# Altium project PCB_Project.PrjPcb
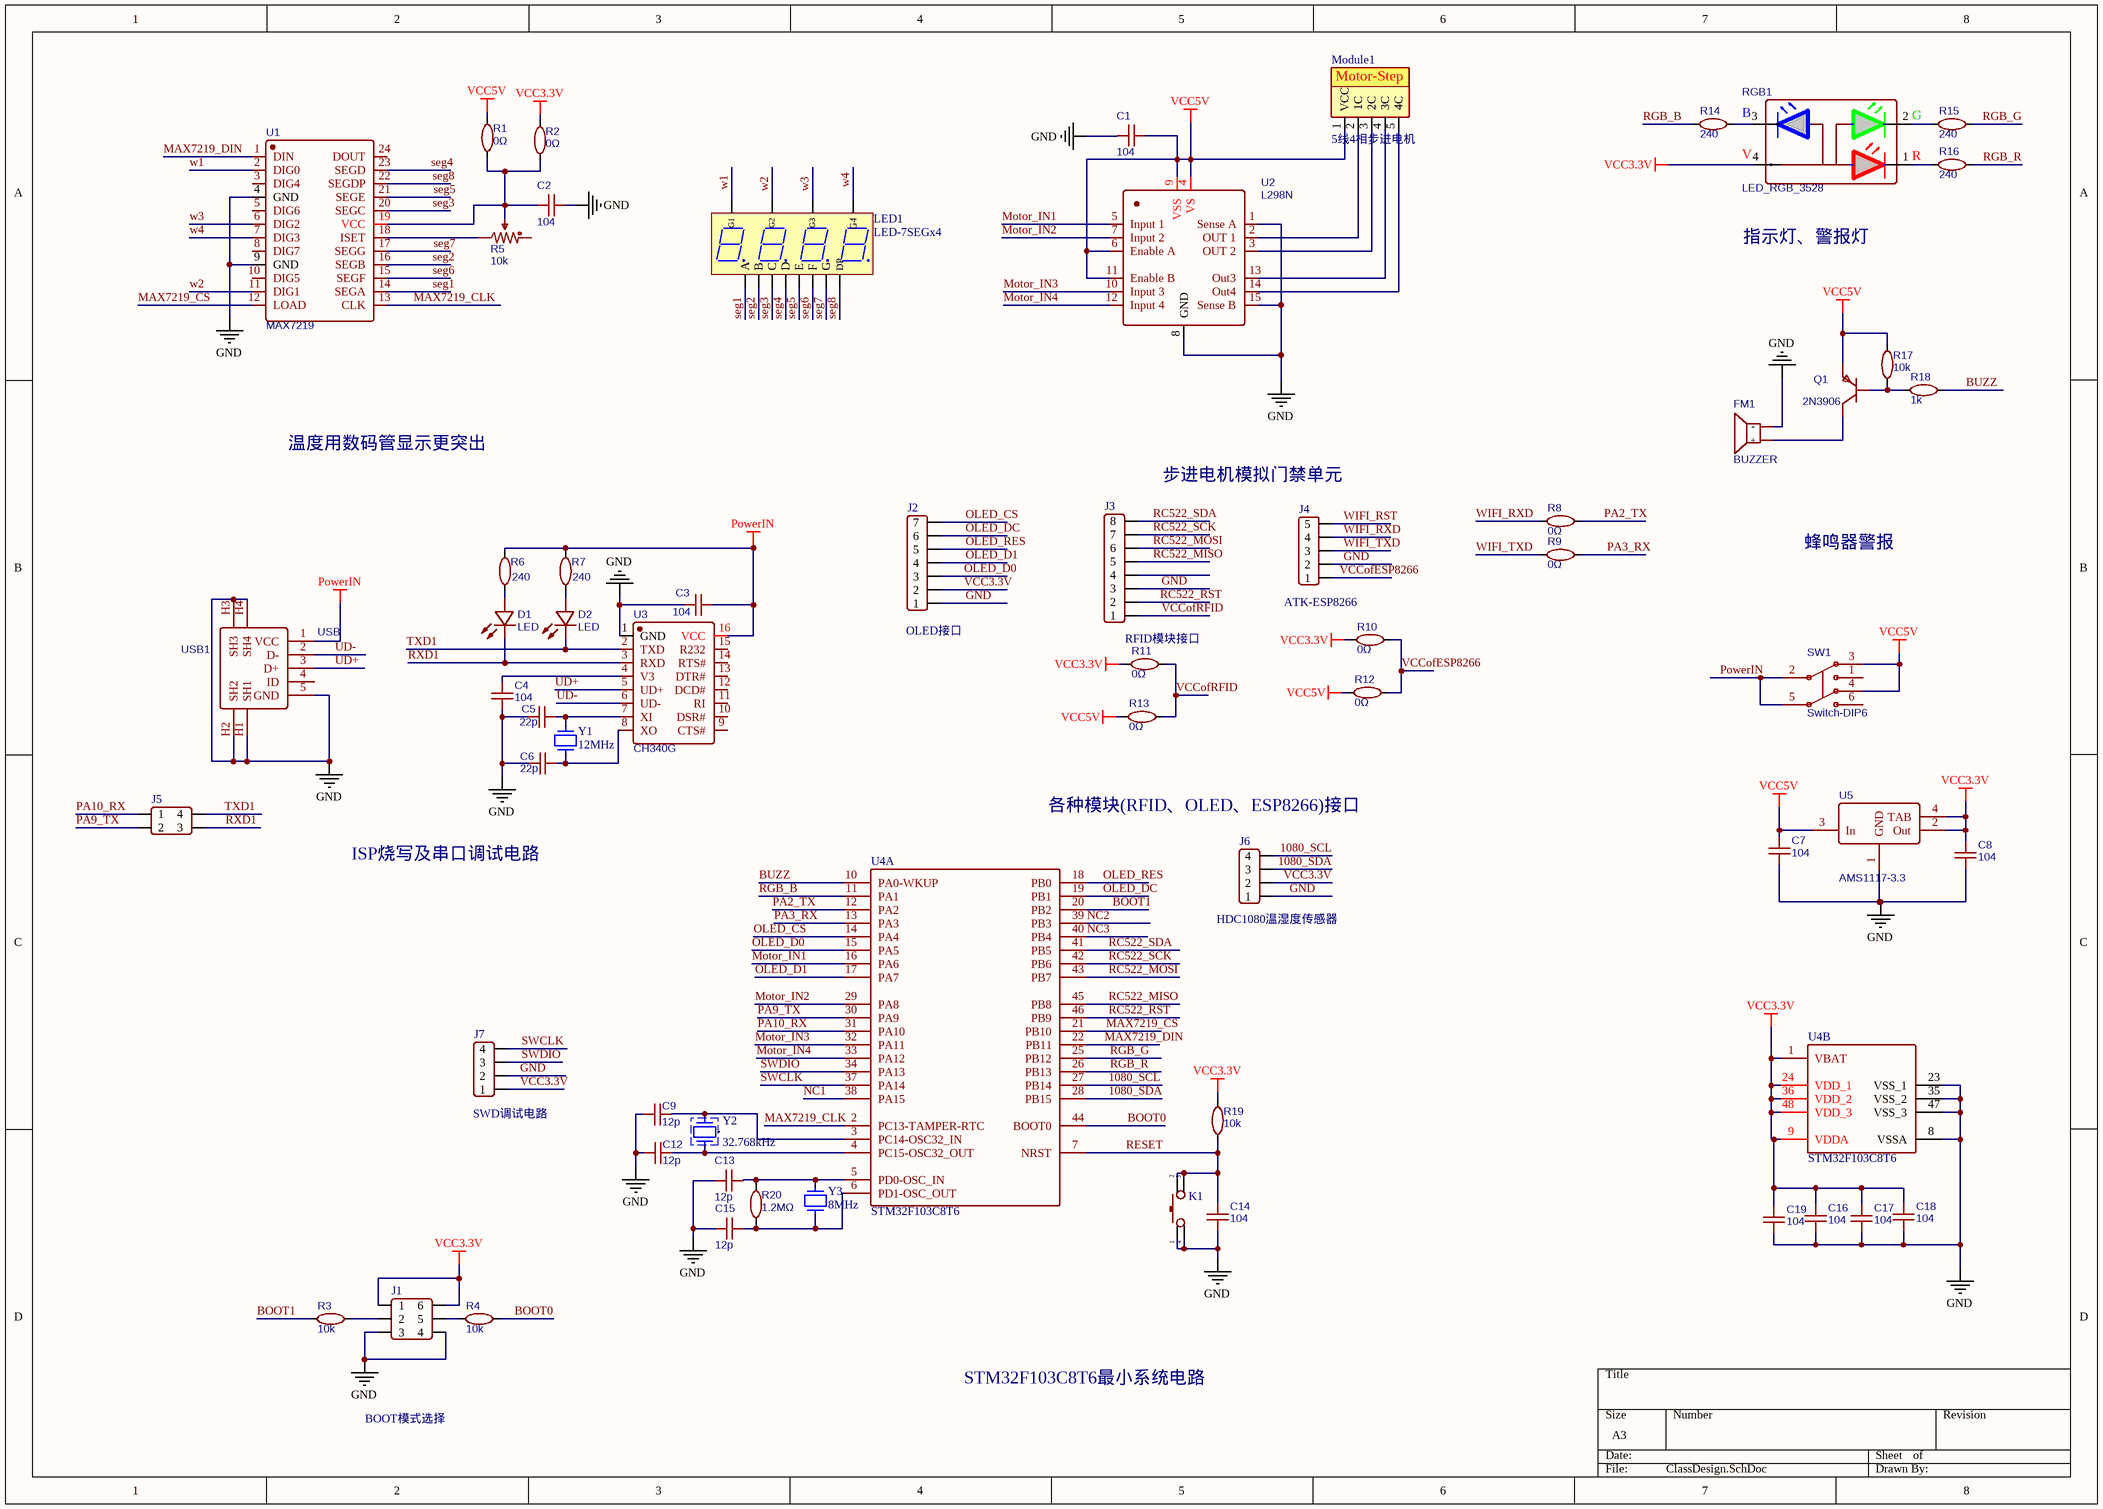
[diagram p0: ClassDesign.SchDoc]
1 sheet, 62 parts. Net scope: global (net labels, ports and power ports of the same name join across sheets).
Board file: ClassDesign.PcbDoc

## Sheet ClassDesign.SchDoc
size A3

### Parts
C1  104  [CAP_0805]
C2  104  [CAP_0805]
C3  104  [CAP_0805]
C4  104  [CAP_0805]
C5  22p  [CAP_0805]
C6  22p  [CAP_0805]
C7  104  [CAP_0805]
C8  104  [CAP_0805]
C9  12p  [CAP_0805]
C12  12p  [CAP_0805]
C13  12p  [CAP_0805]
C14  104  [CAP_0805]
C15  12p  [CAP_0805]
C16  104  [CAP_0805]
C17  104  [CAP_0805]
C18  104  [CAP_0805]
C19  104  [CAP_0805]
D1  LED  [LED_0805_R]
D2  LED  [LED_0805_R]
FM1  BUZZER  [BUZZ-12*7.5]
J1  BOOT模式选择  [Header 2.54_2X3]
J2  OLED接口  [Header 2.54X7]
J3  RFID模块接口  [Header 2.54X8]
J4  ATK-ESP8266  [Header 2.54X5]
J5  Header 2.54_2X2  [Header 2.54_2x2]  (value not drawn)
J6  HDC1080温湿度传感器  [Header 2.54X4]
J7  SWD调试电路  [Header 2.54X4]
K1  DIP-Button_4P  [TSW DIP-6*6*6]  (value not drawn)
LED1  LED-7SEGx4  [DISP_0.56_4]
Module1  5线4相步进电机  [XH_2.54_5P]
Q1  2N3906  [TO_92A]
R1  0Ω  [RES_0805]
R2  0Ω  [RES_0805]
R3  10k  [RES_0805]
R4  10k  [RES_0805]
R5  10k  [RES_POT-3362P]
R6  240  [RES_0805]
R7  240  [RES_0805]
R8  0Ω  [RES_0805]
R9  0Ω  [RES_0805]
R10  0Ω  [RES_0805]
R11  0Ω  [RES_0805]
R12  0Ω  [RES_0805]
R13  0Ω  [RES_0805]
R14  240  [RES_0805]
R15  240  [RES_0805]
R16  240  [RES_0805]
R17  10k  [RES_0805]
R18  1k  [RES_0805]
R19  10k  [RES_0805]
R20  1.2MΩ  [RES_0805]
RGB1  LED_RGB_3528  [LED_3528_RGB]
SW1  Switch-DIP6  [Switch_6]
U1  MAX7219  [SOIC_24W]
U2  L298N  [Multiwatt_15]
U3  CH340G  [SOP-16]
U4  STM32F103C8T6  [LQFP_48_7X7]  (parts A,B of 2)
U5  AMS1117-3.3  [SOT-223_3]
USB1  USB  [USB_Micro_DIP41]
Y1  12MHz  [XTAL1]
Y2  32.768kHz  [XTAL-D2X6]
Y3  8MHz  [XTAL1]

### Nets
GND: C1.1 C2.2 C3.2 C4.1 C5.1 C6.1 C7.2 C8.2 C9.1 C12.1 C13.2 C14.2 C15.2 C16.2 C17.2 C18.2 C19.2 FM1.2(－) J1.3 J1.4 J2.1 J3.3 J4.2 J6.1 J7.2 K1.1 K1.4 U1.4(GND) U1.9(GND) U2.1(Sense_A) U2.8(GND) U2.15(Sense_B) U3.1(GND) U4.8(VSSA) U4.23(VSS_1) U4.35(VSS_2) U4.47(VSS_3) U5.1(GND) USB1.5(GND) USB1.H1(SH1) USB1.H2(SH2) USB1.H3(SH3) USB1.H4(SH4)
PowerIN: C3.1 R6.2 R7.2 SW1.2(C) SW1.5(C) U3.16(VCC) USB1.1(VCC)
VCC3.3V: C8.1 C16.1 C17.1 C18.1 C19.1 J1.1 J1.6 J2.2 J6.2 J7.1 R2.2 R10.2 R11.2 R19.2 RGB1.4 U4.1(VBAT) U4.9(VDDA) U4.24(VDD_1) U4.36(VDD_2) U4.48(VDD_3) U5.2(Out) U5.4(TAB)
VCC5V: C1.2 C7.1 Module1.1(VCC) Q1.1(E) R1.2 R12.2 R13.2 R17.2 SW1.3(NC) SW1.4(NC) U2.4(VS) U2.6(Enable_A) U2.9(VSS) U2.11(Enable_B) U5.3(In)
1080_SCL: J6.4 U4.27(PB14)
1080_SDA: J6.3 U4.28(PB15)
BOOT0: R4.2 U4.44(BOOT0)
BOOT1: R3.1 U4.20(PB2)
BUZZ: R18.2 U4.10(PA0-WKUP)
MAX7219_CLK: U1.13(CLK) U4.2(PC13-TAMPER-RTC)
MAX7219_CS: U1.12(LOAD) U4.21(PB10)
MAX7219_DIN: U1.1(DIN) U4.22(PB11)
Motor_IN1: U2.5(Input_1) U4.16(PA6)
Motor_IN2: U2.7(Input_2) U4.29(PA8)
Motor_IN3: U2.10(Input_3) U4.32(PA11)
Motor_IN4: U2.12(Input_4) U4.33(PA12)
NC1: U4.38(PA15)
NC2: U4.39(PB3)
NC3: U4.40(PB4)
OLED_CS: J2.7 U4.14(PA4)
OLED_D0: J2.3 U4.15(PA5)
OLED_D1: J2.4 U4.17(PA7)
OLED_DC: J2.6 U4.19(PB1)
OLED_RES: J2.5 U4.18(PB0)
PA2_TX: R8.2 U4.12(PA2)
PA3_RX: R9.2 U4.13(PA3)
PA9_TX: J5.2 U4.30(PA9)
PA10_RX: J5.1 U4.31(PA10)
RC522_MISO: J3.5 U4.45(PB8)
RC522_MOSI: J3.6 U4.43(PB7)
RC522_RST: J3.2 U4.46(PB9)
RC522_SCK: J3.7 U4.42(PB6)
RC522_SDA: J3.8 U4.41(PB5)
RESET: C14.1 K1.2 K1.3 R19.1 U4.7(NRST)
RGB_B: R14.2 U4.11(PA1)
RGB_G: R15.2 U4.25(PB12)
RGB_R: R16.2 U4.26(PB13)
RXD1: D1.C J5.3 U3.3(RXD)
seg1: LED1.11(A) U1.14(SEGA)
seg2: LED1.7(B) U1.16(SEGB)
seg3: LED1.4(C) U1.20(SEGC)
seg4: LED1.2(D) U1.23(SEGD)
seg5: LED1.1(E) U1.21(SEGE)
seg6: LED1.10(F) U1.15(SEGF)
seg7: LED1.5(G) U1.17(SEGG)
seg8: LED1.3(DP) U1.22(SEGDP)
SWCLK: J7.4 U4.37(PA14)
SWDIO: J7.3 U4.34(PA13)
TXD1: D2.C J5.4 U3.2(TXD)
UD+: U3.5(UD+) USB1.3(D+)
UD-: U3.6(UD-) USB1.2(D-)
VCCofESP8266: J4.1 R10.1 R12.1
VCCofRFID: J3.1 R11.1 R13.1
w1: LED1.12(G1) U1.2(DIG0)
w2: LED1.9(G2) U1.11(DIG1)
w3: LED1.8(G3) U1.6(DIG2)
w4: LED1.6(G4) U1.7(DIG3)
WIFI_RST: J4.5
WIFI_RXD: J4.4 R8.1
WIFI_TXD: J4.3 R9.1
NetC2_1: C2.1 R1.1 R2.1 R5.2 U1.19(VCC)
NetC4_2: C4.2 U3.4(V3)
NetC5_2: C5.2 U3.7(XI) Y1.1
NetC6_2: C6.2 U3.8(XO) Y1.2
NetC9_2: C9.2 U4.3(PC14-OSC32_IN) Y2.2
NetC12_2: C12.2 U4.4(PC15-OSC32_OUT) Y2.1
NetC13_1: C13.1 R20.1 U4.5(PD0-OSC_IN) Y3.2
NetC15_1: C15.1 R20.2 U4.6(PD1-OSC_OUT) Y3.1
NetD1_A: D1.A R6.1
NetD2_A: D2.A R7.1
NetFM1_1: FM1.1(+) Q1.3(C)
NetJ1_2: J1.2 R3.2
NetJ1_5: J1.5 R4.1
NetModule1_2: Module1.2(1C) U2.2(OUT_1)
NetModule1_3: Module1.3(2C) U2.3(OUT_2)
NetModule1_4: Module1.4(3C) U2.13(Out3)
NetModule1_5: Module1.5(4C) U2.14(Out4)
NetQ1_2: Q1.2(B) R17.1 R18.1
NetR5_1: R5.1 U1.18(ISET)
NetR14_1: R14.1 RGB1.3
NetR15_1: R15.1 RGB1.2
NetR16_1: R16.1 RGB1.1

Not connected (* = marked no-connect by the designer): J3 4; R5 3; SW1 1(ON) 6(ON); U1 3(DIG4) 5(DIG6) 8(DIG7) 10(DIG5) 24(DOUT); U3 9(CTS#) 10(DSR#) 11(RI) 12(DCD#) 13(DTR#) 14(RTS#) 15(R232); USB1 4(ID); Y2 H1

### Notes on the sheet
- 指示灯、警报灯
- 温度用数码管显示更突出
- 步进电机模拟门禁单元
- 蜂鸣器警报
- (near J6) 各种模块(RFID、OLED、ESP8266)接口
- ISP烧写及串口调试电路
- STM32F103C8T6最小系统电路
- (in symbol 5线4相步进电机) Motor-Step
- (in symbol LED_RGB_3528) B; G; V; R

### Library data of the parts
C1-C9 C12-C19 = CAP_0805: BOM_Manufacturer: Samsung Electro-Mechanics; BOM_Manufacturer Part: CL10B104KB8WPNC; nameAlias: Capacitance; Contributor: LCSC; BOM_Supplier: LCSC; BOM_Supplier Part: C307348; spicePre: C; spiceSymbolName: CL10B104KB8WPNC
D1 D2 = LED_0805: 发光LED; BOM_Manufacturer: ARKLED; BOM_Manufacturer Part: D-G080508G1; Contributor: LCSC; BOM_Supplier: LCSC; BOM_Supplier Part: C107402; spicePre: L; spiceSymbolName: D-G080508G1
FM1 = BUZZER: 蜂鸣器; BOM_Manufacturer: HNDZ; BOM_Manufacturer Part: TMB12A12; BOM_Supplier: LCSC; BOM_Supplier Part: C96079; spicePre: B; spiceSymbolName: TMB12A12
J1 = Header 2.54_2X3
J2 = Header 2.54_7
J3 = Header 2.54_8
J4 = Header 2.54_5
J6 J7 = Header 2.54_4
K1 = DIP-Button_4P: 按键，直插，6*6*6
Q1 = 2N3906: 三极管PNP; BOM_Manufacturer: BLUE ROCKET; Contributor: LCSC; BOM_Supplier: LCSC; BOM_Supplier Part: C305396; BOM_Manufacturer Part: 2N3906; spicePre: Q; spiceSymbolName: 2N3906_C305396
R1-R4 R6-R20 = RES_0805: BOM_Manufacturer: YAGEO; BOM_Manufacturer Part: RC0402JR-07100KL; nameAlias: Resistance (Ohms); BOM_Supplier: LCSC; BOM_Supplier Part: C106234; spicePre: R; spiceSymbolName: RC0402JR-07100KL
R5 = RES_POT-3362P: 可调电阻3362P; BOM_Manufacturer: Chengdu Guosheng Tech; BOM_Manufacturer Part: 3362P-1-102; Resistance(Ohms): 1K; nameAlias: Resistance (Ohms); Contributor: LCSC; BOM_Supplier: LCSC; BOM_Supplier Part: C118947; spicePre: R; spiceSymbolName: 3362P-1-102
RGB1 = LED_RGB_3528: BOM_Manufacturer: NATIONSTAR; BOM_Manufacturer Part: FM-3528RGBA-HF; Contributor: LCSC; BOM_Supplier: LCSC; BOM_Supplier Part: C108539; spicePre: L; spiceSymbolName: FM-3528RGBA-HF
SW1 = Switch-DIP6: 6脚自锁开关; BOM_Manufacturer: PANASONIC; BOM_Manufacturer Part: ESB33535; BOM_Supplier: LCSC; BOM_Supplier Part: C79134; spicePre: S; spiceSymbolName: ESB33535
U1 = MAX7219: BOM_Manufacturer: MAXIM; BOM_Manufacturer Part: max7219cng; spicePre: X; BOM_Supplier: LCSC; image: //image.lceda.cn/szlcsc/C29160.jpg; BOM_Supplier Part: C29160; spiceSymbolName: max7219cng
U2 = L298N: BOM_Manufacturer: HGSEMI; Contributor: LCSC; BOM_Supplier: LCSC; BOM_Supplier Part: C434589; BOM_Manufacturer Part: L298N; spicePre: U; spiceSymbolName: L298N
U3 = CH340G: BOM_Manufacturer: WCH; SMT Type: Basic; timeStamp: 1468327462; BOM_Supplier: LCSC; BOM_Manufacturer Part: CH340G; BOM_LCSC Assembly: Yes; image: //image.lceda.cn/szlcsc/C14267.jpg; BOM_Supplier Part: C14267; spicePre: U; spiceSymbolName: CH340G
U5 = AMS1117-3.3: BOM_Manufacturer: SK; Contributor: LCSC; SMT Type: Extend; BOM_Supplier: LCSC; BOM_Supplier Part: C165482; BOM_Manufacturer Part: AMS1117-3.3; BOM_LCSC Assembly: Yes; spicePre: U; spiceSymbolName: AMS1117-3.3_C165482
USB1 = MicroUSB: BOM_Manufacturer: SHOU HAN; BOM_Manufacturer Part: MicroXNJ; Contributor: LCSC; BOM_Supplier: LCSC; BOM_Supplier Part: C404969; spicePre: U; spiceSymbolName: MICROXNJ
Y1 Y3 = XTAL-2: 晶振
Y2 = XTAL-3: 晶振3脚